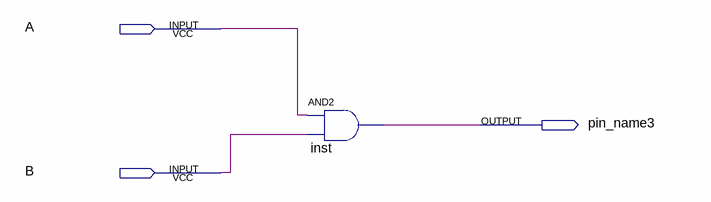
[diagram p0: schematic sheet]
// Quartus schematic Gatedemo.bdf as structural Verilog: 1 symbols, 3 pins
module Gatedemo (
  input  A,
  input  B,
  output pin_name3
);

  and inst (pin_name3, A, B);
endmodule
